# EAGLE design plcc44-to-dip44 (EAGLE 7.2.0)
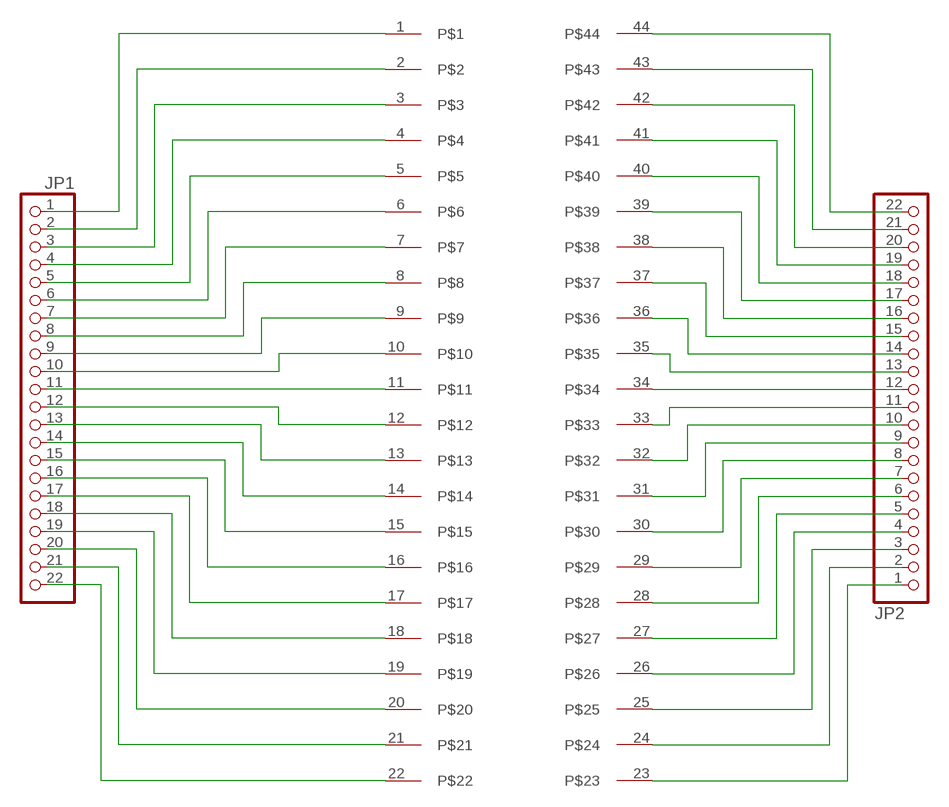
[diagram p0: schematic, sheet 1]

## Parts
JP1  PINHD-1X22  [1X22]
JP2  PINHD-1X22  [1X22]
U$1  PLCC44-SOCKET  [S44]

## Nets
N$1: JP1.1 U$1.1
N$2: JP1.2 U$1.2
N$3: JP1.3 U$1.3
N$4: JP1.4 U$1.4
N$5: JP1.5 U$1.5
N$6: JP1.6 U$1.6
N$7: JP1.7 U$1.7
N$8: JP1.8 U$1.8
N$9: JP1.9 U$1.9
N$10: JP1.10 U$1.10
N$11: JP1.11 U$1.11
N$12: JP1.12 U$1.12
N$13: JP1.13 U$1.13
N$14: JP1.14 U$1.14
N$15: JP1.15 U$1.15
N$16: JP1.16 U$1.16
N$17: JP1.17 U$1.17
N$18: JP1.18 U$1.18
N$19: JP1.19 U$1.19
N$20: JP1.20 U$1.20
N$21: JP1.21 U$1.21
N$22: JP1.22 U$1.22
N$23: JP2.22 U$1.44
N$24: JP2.21 U$1.43
N$25: JP2.20 U$1.42
N$26: JP2.19 U$1.41
N$27: JP2.18 U$1.40
N$28: JP2.17 U$1.39
N$29: JP2.16 U$1.38
N$30: JP2.15 U$1.37
N$31: JP2.14 U$1.36
N$32: JP2.13 U$1.35
N$33: JP2.12 U$1.34
N$34: JP2.11 U$1.33
N$35: JP2.10 U$1.32
N$36: JP2.9 U$1.31
N$37: JP2.8 U$1.30
N$38: JP2.7 U$1.29
N$39: JP2.6 U$1.28
N$40: JP2.5 U$1.27
N$41: JP2.4 U$1.26
N$42: JP2.3 U$1.25
N$43: JP2.2 U$1.24
N$44: JP2.1 U$1.23

## Library data of the parts
JP1 JP2 = pinhead:PINHD-1X22: PIN HEADER
U$1 = plcc-socket:PLCC44-SOCKET

## Board
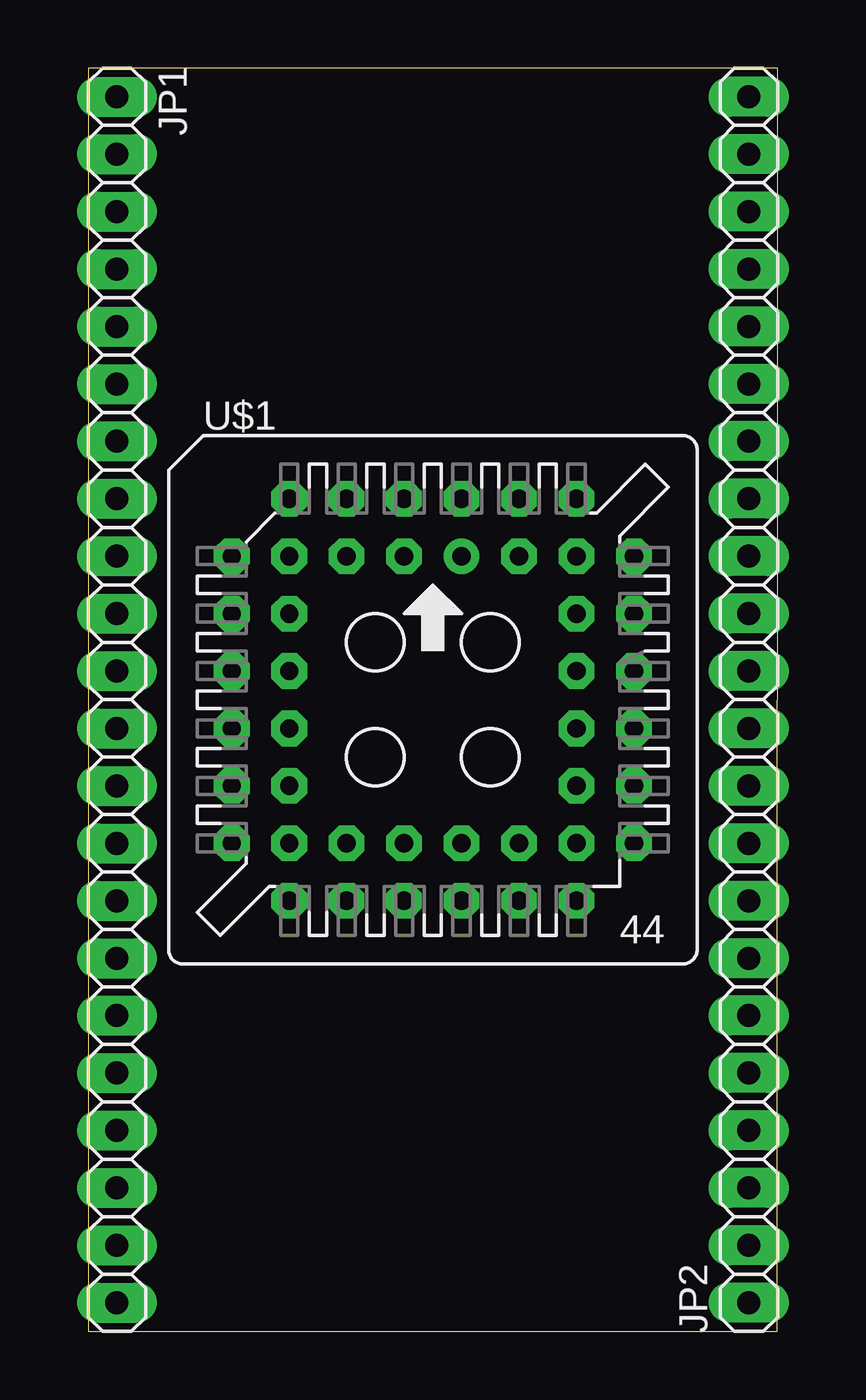
[diagram p1: board, top side]
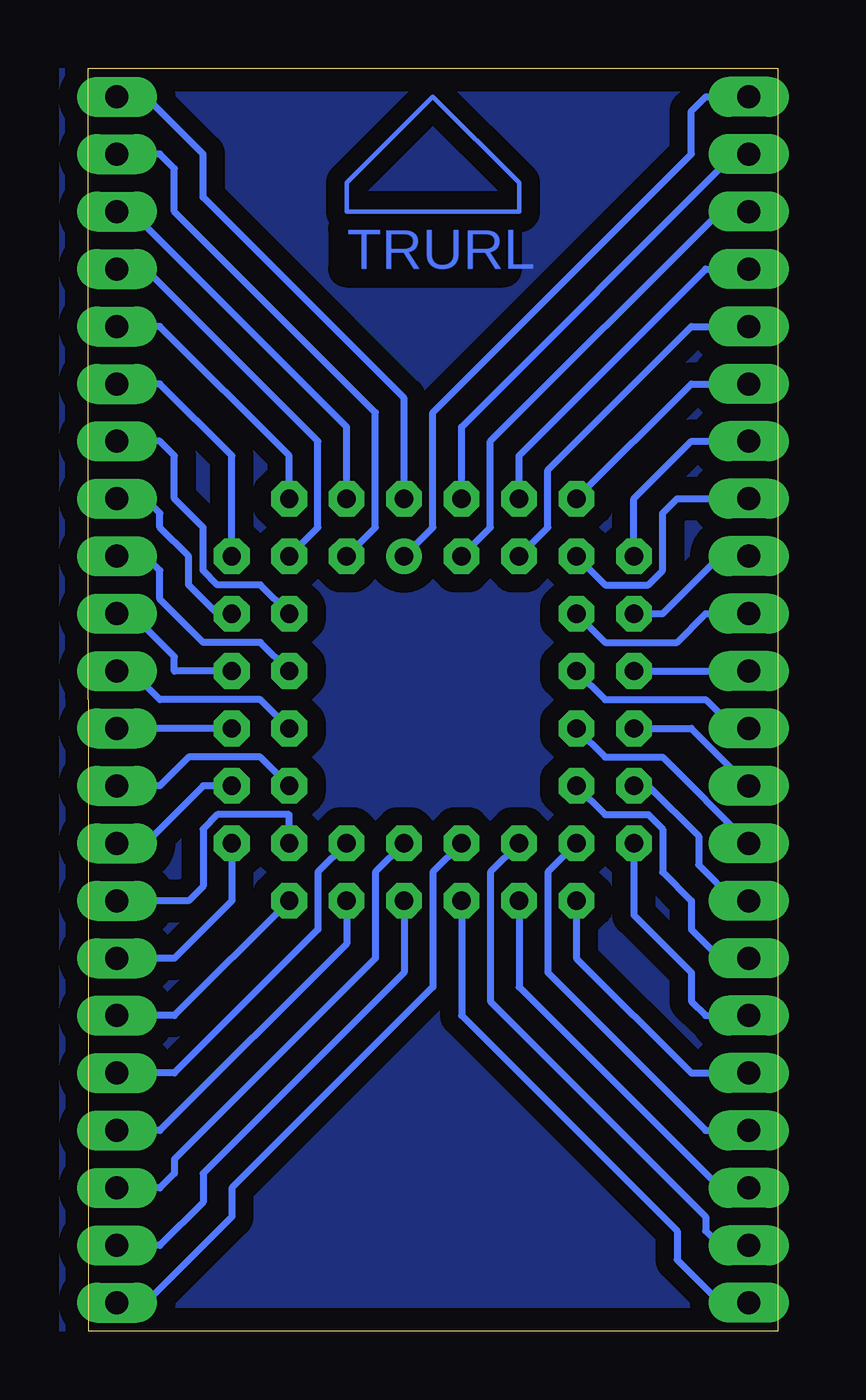
[diagram p2: board, bottom side, seen from below]

Size 30.48 x 55.88 mm. Coordinates in mm from the lower left corner, seen from the top.
Outline: 0,0 30.46,0 30.48,55.88 0,55.88 0,0
Copper layers (1*16): Top 0.035mm / dielectric 1.5mm / Bottom 0.035mm
Design rules "default *": minimum track width 10mil, minimum drill 24mil, track to track 8mil, track to pad 8mil, pad to pad 8mil, via to via 8mil, smd to smd 8mil, copper to edge 40mil, drill to drill 8mil, minimum pad ring 15mil, minimum via ring 8mil, stop-mask expansion 4mil, vias tented up to drill 0mil, thermal gap 10mil

### Footprints (pad centres in the part's own frame; a part is rotated, then mirrored left to right if it is on the bottom)
1X22 = drill 1.016 long: 1 -26.67,0; 2 -24.13,0; 3 -21.59,0; 4 -19.05,0; 5 -16.51,0; 6 -13.97,0; 7 -11.43,0; 8 -8.89,0; 9 -6.35,0; 10 -3.81,0; 11 -1.27,0; 12 1.27,0; 13 3.81,0; 14 6.35,0; 15 8.89,0; 16 11.43,0; 17 13.97,0; 18 16.51,0; 19 19.05,0; 20 21.59,0; 21 24.13,0; 22 26.67,0
S44 = drill 0.813: 1 1.27,6.35 | drill 0.813 octagon: 2 -1.27,8.89; 3 -1.27,6.35; 4 -3.81,8.89; 5 -3.81,6.35; 6 -6.35,8.89; 7 -8.89,6.35; 8 -6.35,6.35; 9 -8.89,3.81; 10 -6.35,3.81; 11 -8.89,1.27; 12 -6.35,1.27; 13 -8.89,-1.27; 14 -6.35,-1.27; 15 -8.89,-3.81; 16 -6.35,-3.81; 17 -8.89,-6.35; 18 -6.35,-8.89; 19 -6.35,-6.35; 20 -3.81,-8.89; 21 -3.81,-6.35; 22 -1.27,-8.89; 23 -1.27,-6.35; 24 1.27,-8.89; 25 1.27,-6.35; 26 3.81,-8.89; 27 3.81,-6.35; 28 6.35,-8.89; 29 8.89,-6.35; 30 6.35,-6.35; 31 8.89,-3.81; 32 6.35,-3.81; 33 8.89,-1.27; 34 6.35,-1.27; 35 8.89,1.27; 36 6.35,1.27; 37 8.89,3.81; 38 6.35,3.81; 39 8.89,6.35; 40 6.35,8.89; 41 6.35,6.35; 42 3.81,8.89; 43 3.81,6.35; 44 1.27,8.89

### Placement (x,y rotation side)
JP1  1.27,27.94 270 top
JP2  29.21,27.94 90 top
U$1  15.24,27.94 0 top

### Tracks (layer width: path | path; a pad name or v marks a point on that pad's centre or on a via)
N$1
  Bottom 0.305: U$1.1 15.24,35.56 15.24,40.64 3.81,52.07 3.81,53.98 3.17,54.61 JP1.1
N$2
  Bottom 0.305: U$1.2 13.97,40.01 1.91,52.07 JP1.2
N$3
  Bottom 0.305: U$1.3 12.7,35.56 12.7,39.37 2.54,49.53 JP1.3
N$4
  Bottom 0.305: U$1.4 11.43,38.73 3.17,46.99 JP1.4
N$5
  Bottom 0.305: U$1.5 10.16,35.56 10.16,38.1 3.81,44.45 JP1.5
N$6
  Bottom 0.305: U$1.6 3.81,41.91 JP1.6
N$7
  Bottom 0.305: U$1.7 6.35,36.83 3.81,39.37 JP1.7
N$8
  Bottom 0.305: U$1.8 7.62,33.02 5.71,33.02 5.08,33.66 5.08,36.2 4.45,36.83 JP1.8
N$9
  Bottom 0.305: U$1.9 5.08,31.75 2.54,34.29 JP1.9
N$10
  Bottom 0.305: U$1.10 7.62,30.48 4.45,30.48 3.17,31.75 JP1.10
N$11
  Bottom 0.305: U$1.11 JP1.11
N$12
  Bottom 0.305: U$1.12 7.62,27.94 3.17,27.94 1.91,26.67 JP1.12
N$13
  Bottom 0.305: U$1.13 3.81,26.67 JP1.13
N$14
  Bottom 0.305: U$1.14 7.62,25.4 5.08,25.4 JP1.14
N$15
  Bottom 0.305: U$1.15 5.71,24.13 3.49,21.91 3.49,20.64 1.91,19.05 JP1.15
N$16
  Bottom 0.305: U$1.16 7.62,22.86 5.71,22.86 5.08,22.23 5.08,20.32 3.81,19.05 3.81,17.78 2.54,16.51 JP1.16
N$17
  Bottom 0.305: U$1.17 6.35,18.41 3.81,15.88 3.81,14.61 3.17,13.97 JP1.17
N$18
  Bottom 0.305: U$1.18 8.89,16.51 3.81,11.43 JP1.18
N$19
  Bottom 0.305: U$1.19 10.16,20.32 10.16,15.88 3.17,8.89 JP1.19
N$20
  Bottom 0.305: U$1.20 11.43,15.24 2.54,6.35 JP1.20
N$21
  Bottom 0.305: U$1.21 12.7,20.32 12.7,14.61 3.17,5.08 3.17,4.45 2.54,3.81 JP1.21
N$22
  Bottom 0.305: U$1.22 13.97,13.97 4.45,4.45 4.45,3.17 2.54,1.27 JP1.22
N$23
  Bottom 0.305: U$1.44 16.51,41.27 25.4,50.16 25.4,52.07 27.94,54.61 JP2.22
N$24
  Bottom 0.305: U$1.43 17.78,35.56 17.78,40.64 26.67,49.53 26.67,51.44 27.3,52.07 JP2.21
N$25
  Bottom 0.305: U$1.42 19.05,40.01 28.57,49.53 JP2.20
N$26
  Bottom 0.305: U$1.41 20.32,35.56 20.32,39.37 27.94,46.99 JP2.19
N$27
  Bottom 0.305: U$1.40 21.59,38.73 27.3,44.45 JP2.18
N$28
  Bottom 0.305: U$1.39 24.13,38.73 27.3,41.91 JP2.17
N$29
  Bottom 0.305: U$1.38 22.86,33.02 24.77,33.02 25.4,33.66 25.4,35.56 26.67,36.83 26.67,38.73 27.3,39.37 JP2.16
N$30
  Bottom 0.305: U$1.37 24.77,31.75 26.04,33.02 26.04,34.29 27.3,35.56 27.3,36.2 27.94,36.83 JP2.15
N$31
  Bottom 0.305: U$1.36 22.86,30.48 25.4,30.48 27.3,32.38 27.3,33.66 27.94,34.29 JP2.14
N$32
  Bottom 0.305: U$1.35 26.67,29.21 26.67,29.84 28.57,31.75 JP2.13
N$33
  Bottom 0.305: U$1.34 22.86,27.94 27.3,27.94 28.57,29.21 JP2.12
N$34
  Bottom 0.305: U$1.33 JP2.11
N$35
  Bottom 0.305: U$1.32 22.86,25.4 26.04,25.4 27.3,24.13 JP2.10
N$36
  Bottom 0.305: U$1.31 25.4,24.13 27.94,21.59 JP2.9
N$37
  Bottom 0.305: U$1.30 21.59,22.86 24.77,22.86 25.4,22.23 25.4,19.68 26.04,19.05 JP2.8
N$38
  Bottom 0.305: U$1.29 24.13,19.05 26.67,16.51 JP2.7
N$39
  Bottom 0.305: U$1.28 26.67,13.97 JP2.6
N$40
  Bottom 0.305: U$1.27 20.32,20.32 20.32,17.78 26.67,11.43 JP2.5
N$41
  Bottom 0.305: U$1.26 19.05,17.14 27.3,8.89 JP2.4
N$42
  Bottom 0.305: U$1.25 17.78,20.32 17.78,16.51 26.67,7.62 26.67,6.99 27.3,6.35 JP2.3
N$43
  Bottom 0.305: U$1.24 16.51,15.88 25.4,6.99 25.4,5.71 27.3,3.81 JP2.2
N$44
  Bottom 0.305: U$1.23 15.24,20.32 15.24,15.24 24.13,6.35 24.13,5.08 27.94,1.27 JP2.1
N$45
  Bottom 0.206: 19.05,49.53 11.43,49.53 11.43,50.8 15.24,54.61 19.05,50.8 19.05,49.53
N$46
  pour Bottom (isolate 0.813): 0,0 0,55.88 31.75,55.88 31.75,0

### Text on the board
Bottom: TRURL